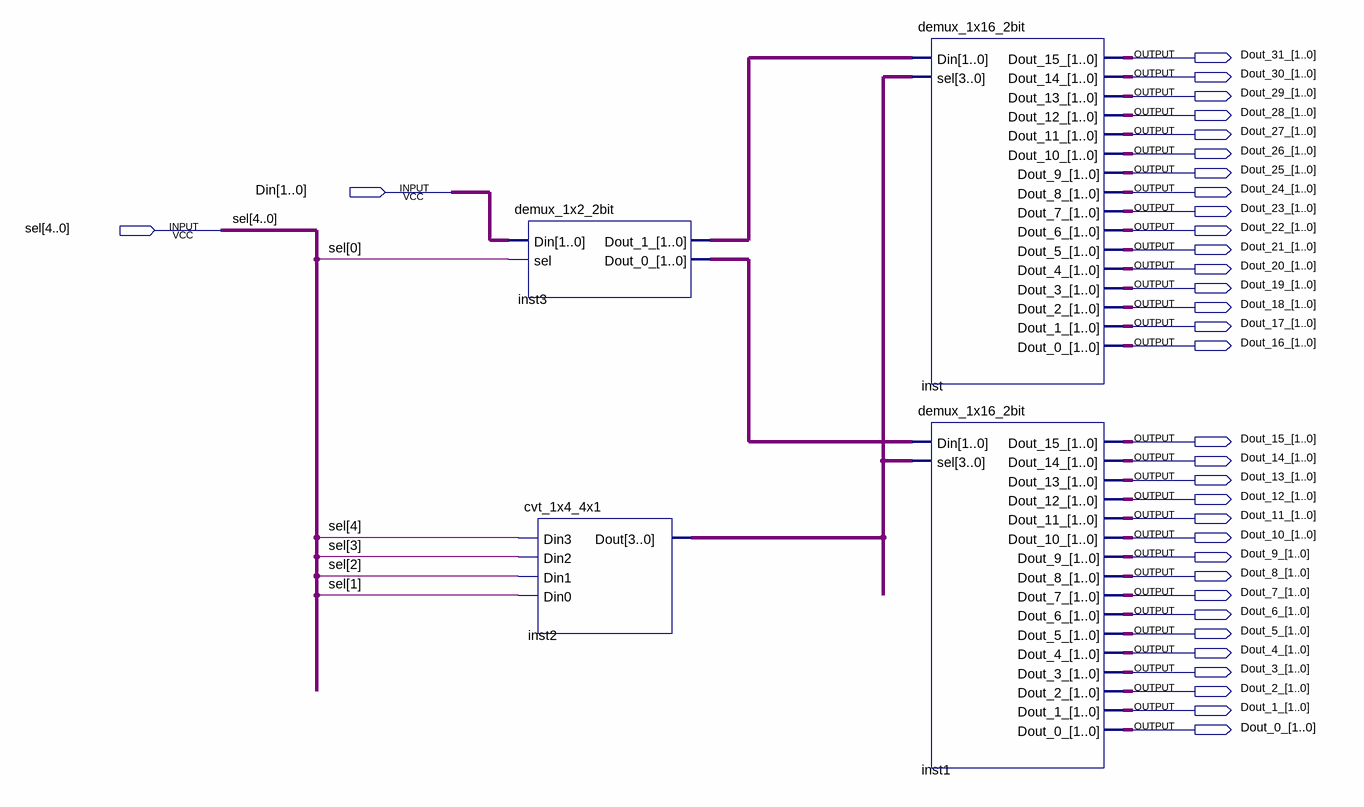
[diagram p0: schematic sheet]
// Quartus schematic demux_1x32_2bit.bdf as structural Verilog: 4 symbols, 34 pins
module demux_1x32_2bit (
  input  [1:0] Din,
  input  [4:0] sel,
  output [1:0] Dout_31_,
  output [1:0] Dout_30_,
  output [1:0] Dout_29_,
  output [1:0] Dout_28_,
  output [1:0] Dout_27_,
  output [1:0] Dout_26_,
  output [1:0] Dout_25_,
  output [1:0] Dout_24_,
  output [1:0] Dout_23_,
  output [1:0] Dout_22_,
  output [1:0] Dout_21_,
  output [1:0] Dout_20_,
  output [1:0] Dout_19_,
  output [1:0] Dout_18_,
  output [1:0] Dout_17_,
  output [1:0] Dout_16_,
  output [1:0] Dout_15_,
  output [1:0] Dout_14_,
  output [1:0] Dout_13_,
  output [1:0] Dout_12_,
  output [1:0] Dout_11_,
  output [1:0] Dout_10_,
  output [1:0] Dout_9_,
  output [1:0] Dout_8_,
  output [1:0] Dout_7_,
  output [1:0] Dout_6_,
  output [1:0] Dout_5_,
  output [1:0] Dout_4_,
  output [1:0] Dout_3_,
  output [1:0] Dout_2_,
  output [1:0] Dout_1_,
  output [1:0] Dout_0_
);

  wire [1:0] inst3_dout_0_, inst3_dout_1_;
  wire [3:0] inst2_dout;

  demux_1x2_2bit inst3 (.Din(Din), .sel(sel[0]), .Dout_1_(inst3_dout_1_), .Dout_0_(inst3_dout_0_));
  cvt_1x4_4x1 inst2 (.Din3(sel[4]), .Din2(sel[3]), .Din1(sel[2]), .Din0(sel[1]), .Dout(inst2_dout));
  demux_1x16_2bit inst (
    .Din(inst3_dout_1_), .sel(inst2_dout), .Dout_15_(Dout_31_), .Dout_14_(Dout_30_), .Dout_13_(Dout_29_),
    .Dout_12_(Dout_28_), .Dout_11_(Dout_27_), .Dout_10_(Dout_26_), .Dout_9_(Dout_25_), .Dout_8_(Dout_24_),
    .Dout_7_(Dout_23_), .Dout_6_(Dout_22_), .Dout_5_(Dout_21_), .Dout_4_(Dout_20_), .Dout_3_(Dout_19_),
    .Dout_2_(Dout_18_), .Dout_1_(Dout_17_), .Dout_0_(Dout_16_));
  demux_1x16_2bit inst1 (
    .Din(inst3_dout_0_), .sel(inst2_dout), .Dout_15_(Dout_15_), .Dout_14_(Dout_14_), .Dout_13_(Dout_13_),
    .Dout_12_(Dout_12_), .Dout_11_(Dout_11_), .Dout_10_(Dout_10_), .Dout_9_(Dout_9_), .Dout_8_(Dout_8_),
    .Dout_7_(Dout_7_), .Dout_6_(Dout_6_), .Dout_5_(Dout_5_), .Dout_4_(Dout_4_), .Dout_3_(Dout_3_),
    .Dout_2_(Dout_2_), .Dout_1_(Dout_1_), .Dout_0_(Dout_0_));
endmodule
